# Altium project MiniPTM.PrjPcb (part 4 of 4)

## Sheet 15-M2_GNSS.SchDoc
size A3; SheetNumber: 14; SheetTotal: 15
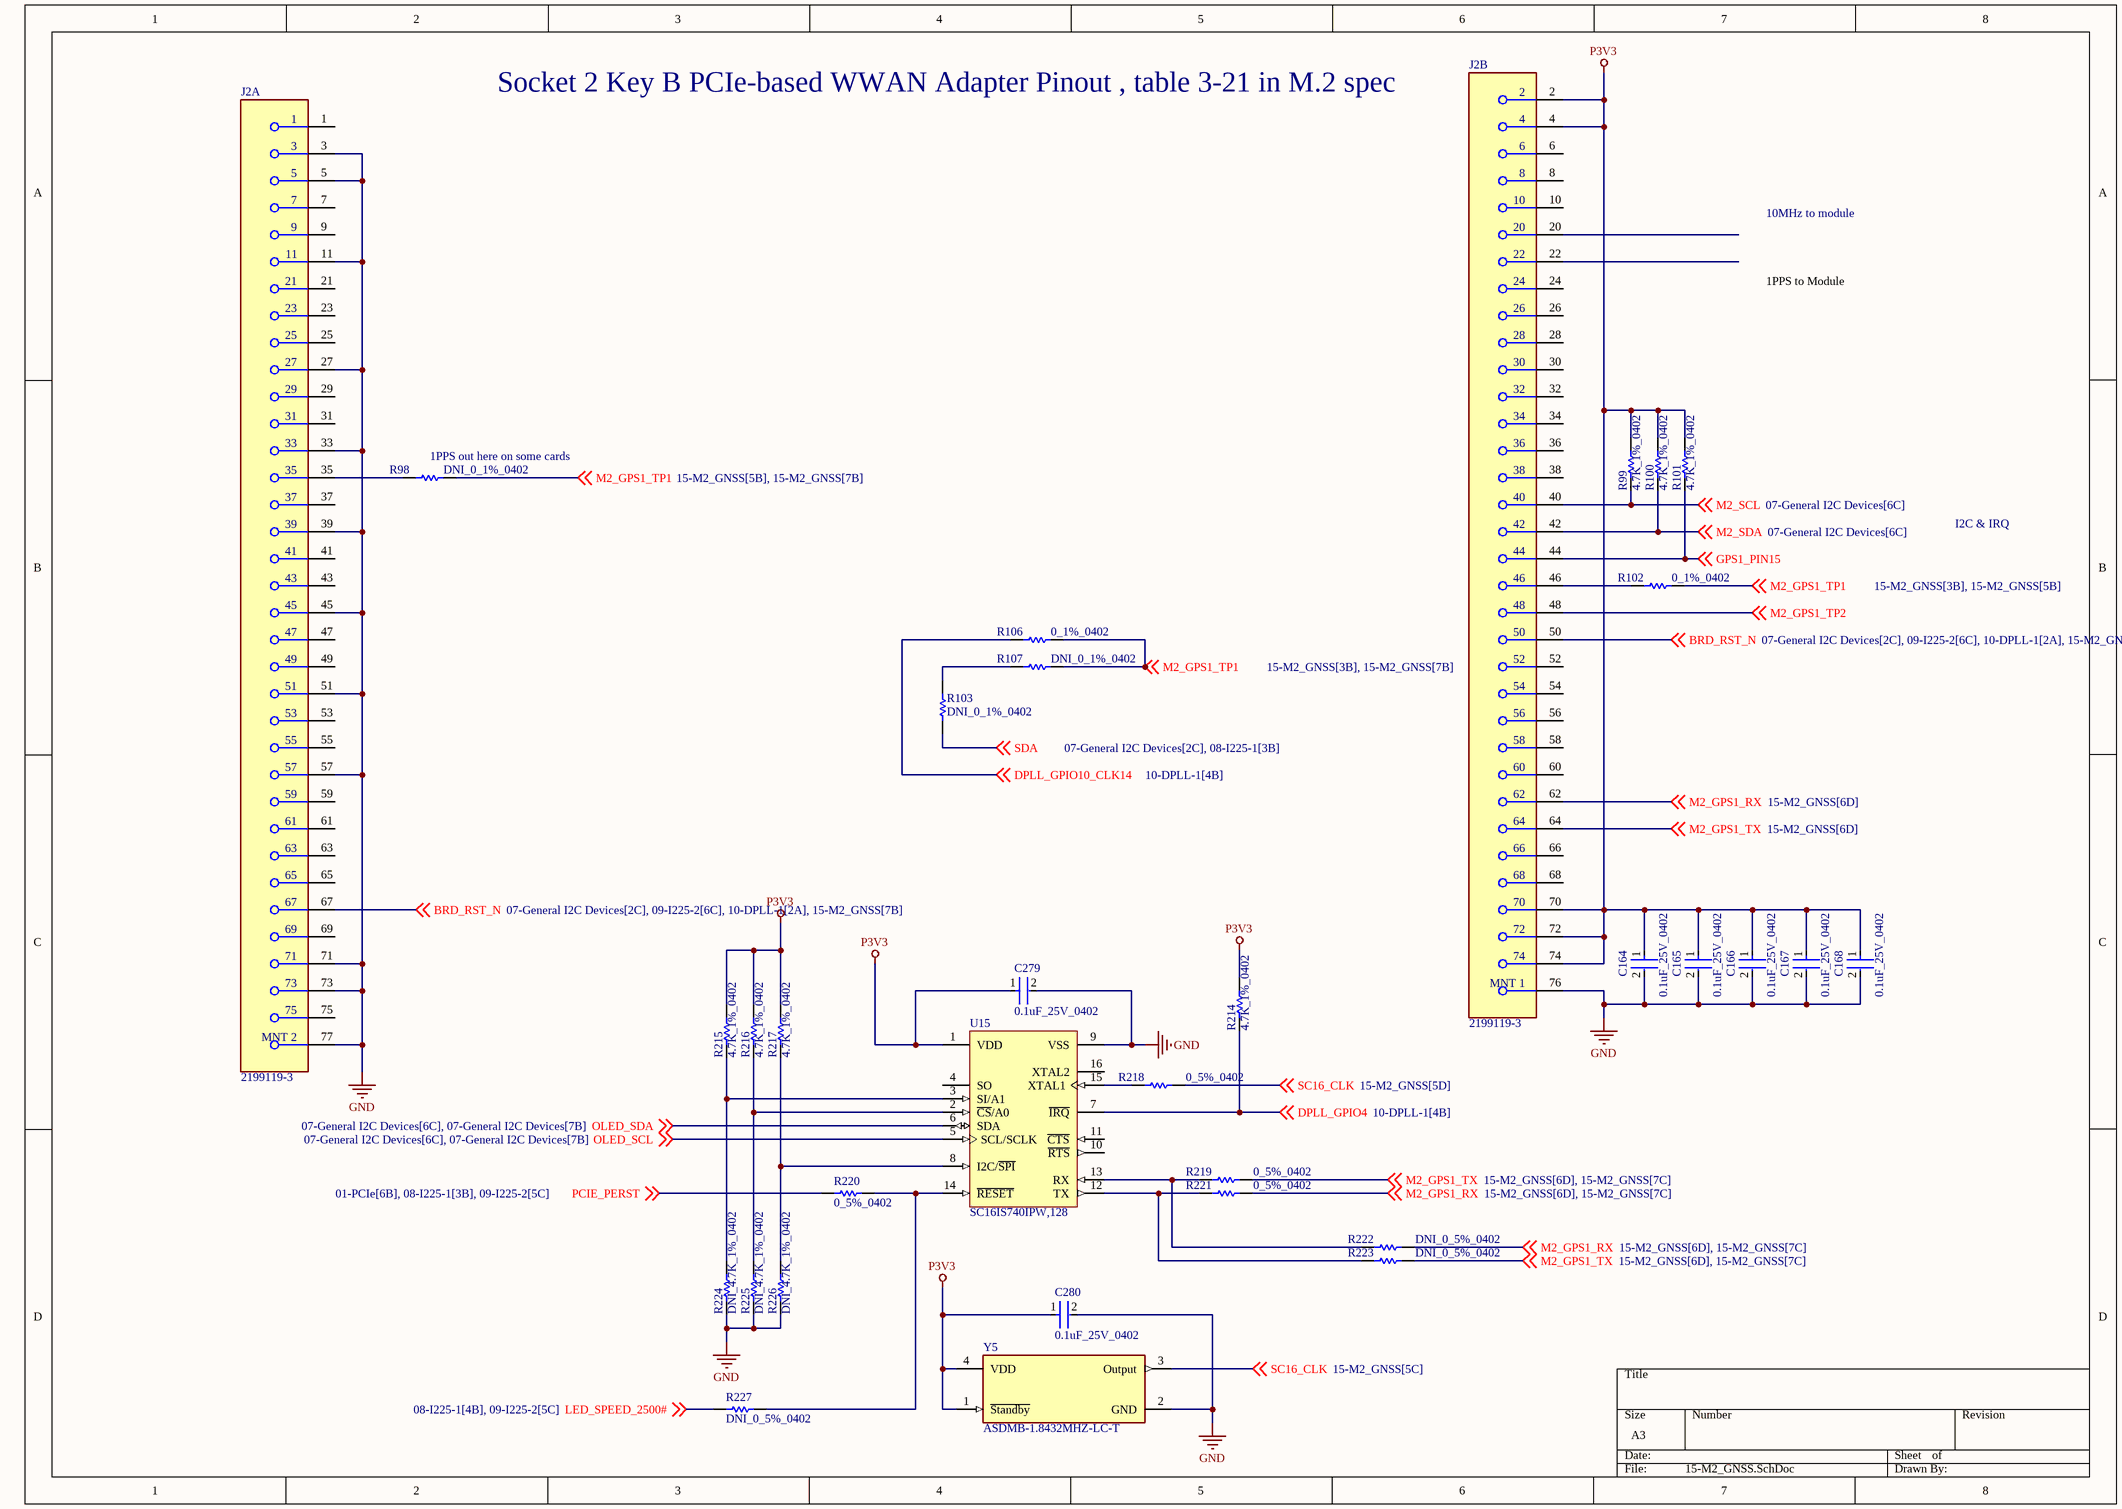
[diagram p14: 15-M2_GNSS.SchDoc]

### Parts
C164  0.1uF_25V_0402  [FP-0402-L_1_0_1-W_0_5_0_1-IPC_C]
C165  0.1uF_25V_0402  [FP-0402-L_1_0_1-W_0_5_0_1-IPC_C]
C166  0.1uF_25V_0402  [FP-0402-L_1_0_1-W_0_5_0_1-IPC_C]
C167  0.1uF_25V_0402  [FP-0402-L_1_0_1-W_0_5_0_1-IPC_C]
C168  0.1uF_25V_0402  [FP-0402-L_1_0_1-W_0_5_0_1-IPC_C]
C279  0.1uF_25V_0402  [FP-0402-L_1_0_1-W_0_5_0_1-IPC_C]
C280  0.1uF_25V_0402  [FP-0402-L_1_0_1-W_0_5_0_1-IPC_C]
J2  2199119-3  [FP-2199119-3-MFG]  (parts A,B of 2)
R98  DNI_0_1%_0402  [RESC1005X40X25LL05T05]  (no BOM)
R99  4.7K_1%_0402  [RESC1005X40X25NL10T10]
R100  4.7K_1%_0402  [RESC1005X40X25NL10T10]
R101  4.7K_1%_0402  [RESC1005X40X25NL10T10]
R102  0_1%_0402  [RESC1005X40X25LL05T05]
R103  DNI_0_1%_0402  [RESC1005X40X25LL05T05]  (no BOM)
R106  0_1%_0402  [RESC1005X40X25LL05T05]
R107  DNI_0_1%_0402  [RESC1005X40X25LL05T05]  (no BOM)
R214  4.7K_1%_0402  [RESC1005X40X25NL10T10]
R215  4.7K_1%_0402  [RESC1005X40X25NL10T10]
R216  4.7K_1%_0402  [RESC1005X40X25NL10T10]
R217  4.7K_1%_0402  [RESC1005X40X25NL10T10]
R218  0_5%_0402  [RESC1005X40X25LL10T10]
R219  0_5%_0402  [RESC1005X40X25LL10T10]
R220  0_5%_0402  [RESC1005X40X25LL10T10]
R221  0_5%_0402  [RESC1005X40X25LL10T10]
R222  DNI_0_5%_0402  [RESC1005X40X25LL10T10]  (no BOM)
R223  DNI_0_5%_0402  [RESC1005X40X25LL10T10]  (no BOM)
R224  DNI_4.7K_1%_0402  [RESC1005X40X25NL10T10]  (no BOM)
R225  DNI_4.7K_1%_0402  [RESC1005X40X25NL10T10]  (no BOM)
R226  DNI_4.7K_1%_0402  [RESC1005X40X25NL10T10]  (no BOM)
R227  DNI_0_5%_0402  [RESC1005X40X25LL10T10]  (no BOM)
U15  SC16IS740IPW,128  [NXP-SOT403-1_V]
Y5  ASDMB-1.8432MHZ-LC-T  [FP-ASDM-ASDMB-MFG]

### Nets
GND: C164.2 C165.2 C166.2 C167.2 C168.2 C279.2 C280.2 J2.3 J2.5 J2.11 J2.27 J2.33 J2.39 J2.45 J2.51 J2.57 J2.71 J2.73 J2.76(MNT_1) J2.77(MNT_2) R224.1 R225.1 R226.1 U15.9(VSS) Y5.2(GND)
P3V3: C164.1 C165.1 C166.1 C167.1 C168.1 C279.1 C280.1 J2.2 J2.4 J2.70 J2.72 J2.74 R99.2 R100.2 R101.2 R214.2 R215.2 R216.2 R217.2 U15.1(VDD) Y5.1(~{Standby}) Y5.4(VDD)
BRD_RST_N: J2.50 J2.67 ; off-sheet BRD_RST_N
DPLL_GPIO4: R214.1 U15.7(~{IRQ}) ; off-sheet DPLL_GPIO4
DPLL_GPIO10_CLK14: R106.1 ; off-sheet DPLL_GPIO10_CLK14
GPS1_PIN15: J2.44 R101.1 ; off-sheet GPS1_PIN15
LED_SPEED_2500#: R227.2 ; off-sheet LED_SPEED_2500#
M2_GPS1_RX: J2.62 R221.1 R222.1 ; off-sheet M2_GPS1_RX
M2_GPS1_TP1: R98.2 R102.2 R106.2 R107.2 ; off-sheet M2_GPS1_TP1
M2_GPS1_TP2: J2.48 ; off-sheet M2_GPS1_TP2
M2_GPS1_TX: J2.64 R219.1 R223.1 ; off-sheet M2_GPS1_TX
M2_SCL: J2.40 R99.1 ; off-sheet M2_SCL
M2_SDA: J2.42 R100.1 ; off-sheet M2_SDA
OLED_SCL: U15.5(SCL/SCLK) ; off-sheet OLED_SCL
OLED_SDA: U15.6(SDA) ; off-sheet OLED_SDA
PCIE_PERST: R220.2 ; off-sheet PCIE_PERST
SC16_CLK: R218.1 Y5.3(Output) ; off-sheet SC16_CLK
SDA: R103.1 ; off-sheet SDA
NetJ2_35: J2.35 R98.1
NetJ2_46: J2.46 R102.1
NetR103_2: R103.2 R107.1
NetR215_1: R215.1 R224.2 U15.3(SI/A1)
NetR216_1: R216.1 R225.2 U15.2(~{CS}/A0)
NetR217_1: R217.1 R226.2 U15.8(I2C/~{SPI})
NetR218_2: R218.2 U15.15(XTAL1)
NetR219_2: R219.2 R222.2 U15.13(RX)
NetR220_1: R220.1 R227.1 U15.14(~{RESET})
NetR221_2: R221.2 R223.2 U15.12(TX)

Not connected (* = marked no-connect by the designer): J2 1 6 7 8 9 10 20 21 22 23 24 25 26 28 29 30 31 32 34 36 37 38 41 43 47 49 52 53 54 55 56 58 59 60 61 63 65 66 68 69 75; U15 4(SO) 10(~{RTS}) 11(~{CTS}) 16(XTAL2)

### Notes on the sheet
- (near J2) Socket 2 Key B PCIe-based WWAN Adapter Pinout , table 3-21 in M.2 spec
- 10MHz to module
- 1PPS to Module
- (near R98) 1PPS out here on some cards
- I2C & IRQ

### Library data of the parts
C164-C168 C279 C280 = CMP-2008-02519-2: General Purpose Ceramic Capacitor, 0402, 100nF, 10%, X7R, 15%, 25V; Package Quantity: 1; Capacitance: 100nF; Min Operating Temperature: -55°C; Voltage: 25V; Voltage Rating: 25V; Construction: Flat; Max Operating Temperature: 125°C; Radiation Hardening: No; Depth: 0.5mm; Thickness: 0.022inch; Voltage Rating (DC): 25V; Number of Pins: 2; Lead Free: Lead Free; Series: -; REACH SVHC: No SVHC; Length: 1mm; Dielectric: X7R; RoHS Compliant: Yes; Mount: Surface Mount; Packaging: Tape and Reel; Case/Package: 0402; Case Code (Imperial): 0402; Termination: SMD/SMT; Width: 0.02inch; Case Code (Metric): 1005; Tolerance: 10%
J2 = CMP-03365-000004-1: CONN M.2 FEMALE 67POS 0.020 GOLD; Contact Current Rating: 500mA; Number of Contacts: 67; PCB Mounting Orientation: Right Angle; Pitch: 0.5mm; Voltage Rating: 50V; Insulation Resistance: 500MR; Row Spacing: 7.55mm; Orientation: Right Angle; Length: 0.862inch; Radiation Hardening: No; Mount: Surface Mount; Contact Plating: Gold; Contact Material: Copper Alloy; Width: 8.7mm; Number of Rows: 2; Color: Black; ELV: Compliant; Housing Color: Black; Number of Positions: 67; Housing Material: Thermoplastic; Gender: Female; Min Operating Temperature: -40°C; Max Operating Temperature: 80°C; RoHS Compliant: Yes; Package Quantity: 1200; Packaging: Tape and Reel; Height: 3.2mm; Termination: Solder; Insulation Material: Thermoplastic; Max Voltage Rating (AC): 50V; Current Rating: 500mA
R98 R102 R103 R106 R107 = CMP-2000-07451-1: Chip Resistor, 0 Ohm, 0.1 W, -55 to 155 degC, 0402 (1005 Metric), RoHS, Tape and Reel; Manufacturer: Panasonic; Voltage Rating (DC): 50V; Temperature Coefficient: 600ppm/��C; Max Power Dissipation: 100mW; Resistance: 0mOhm; Tolerance: 5%; Number of Terminations: 2; Mount: SurfaceMount; Height: 0.35mm; Packaging: TapeandReel; Contact Plating: Tin; Manufacturer URL: http://www.panasonic.com/; Composition: ThickFilm; Max Operating Temperature: 155degC; REACH SVHC: NoSVHC; Case/Package: 0402; Package Reference: 402; Depth: 0.5mm; Package Description: 2-Pin Surface Mount Device, Body 1 x 0.5 mm; Datasheet URL: https://industrial.panasonic.com/cdbs/www-data/pdf/RDA0000/AOA0000C301.pdf; RoHSCompliant: True; Case Code (Imperial): 0402; Military Standard: Not; Min Operating Temperature: -55degC; Power Rating: 100mW; Datasheet Version: 03/2015; Length: 1mm; Case Code (Metric): 1005; Termination: SMD/SMT; Mounting Technology: SurfaceMount; Voltage Rating: 50V; Width: 0.02inch; Package Quantity: 1; Lead Free: LeadFree; Radiation Hardening: No
R99-R101 R214-R217 R224-R226 = CMP-2002-05217-1: Manufacturer: Bourns; Part Number: CR0402-FX-4701GLF
R218-R223 R227 = CMP-2002-04569-1: Manufacturer: KOA Speer; Part Number: RK73Z1ETTP
U15 = CMP-1651-00006-1: Single UART with I2C-Bus/SPI Interface, 64 Bytes of Transmit and Receive FIFOs, IrDA SIR Built-in Support, 2.3 to 3.6 V, -40 to 95 degC, 16-Pin TSSOP (SOT403-1), RoHS, Tape and Reel; Data Rate: 5 Mbps; Supply Voltage Min: 2.3 V; Supply Current Max: 6 mA; Supply Voltage Max: 3.6 V; ComponentLink2Description: Datasheet; Generic Part Number: SC16IS740; ComponentLink3Description: Package Specification; ComponentLink1Description: Manufacturer URL; PackageDescription: 16-Pin Plastic Thin Shrink Small Outline Package, Body 5 x 4.4 mm, Pitch 0.65 mm; Mounting Technology: Surface Mount; Code_JEDEC: MO-153; DatasheetVersion: Rev. 7; Temperature Min: -40 degC; PartNumber: SC16IS740IPW,128; ComponentLink3URL: http://www.nxp.com/documents/outline_drawing/sot403-1_po.pdf; ComponentLink2URL: http://cache.nxp.com/documents/data_sheet/SC16IS740_750_760.pdf?pspll=1; Packing: Tape and Reel; ComponentLink1URL: http://www.nxp.com/; Temperature Max: 95 degC; RoHS: TRUE; PackageVersion: 03-02-18, 02/2003
Y5 = CMP-27762-001563-1: MEMS Oscillator 1.8432MHz ±50ppm LVCMOS 1.8V~3.3V SMD 2.5x2mm; Operating Supply Voltage: 3.3V; Load Capacitance: 15pF; Max Supply Voltage: 4V; Min Supply Voltage: -300mV; Max Supply Current: 16mA; Frequency Stability: 50ppm; Frequency: 1.8432MHz; Height: 0.035inch; Mount: Surface Mount; Max Operating Temperature: 85°C; RoHS Compliant: Yes; Min Operating Temperature: -40°C; Packaging: Tape and Reel; Number of Pins: 4; Length: 0.098inch; Width: 0.079inch; Case/Package: SMD/SMT; Series: Pure Silicon™ ASDMB; Termination: SMD/SMT

## Sheet 16-DPLL_Spare_UFL.SchDoc
size A3; SheetNumber: 15; SheetTotal: 15
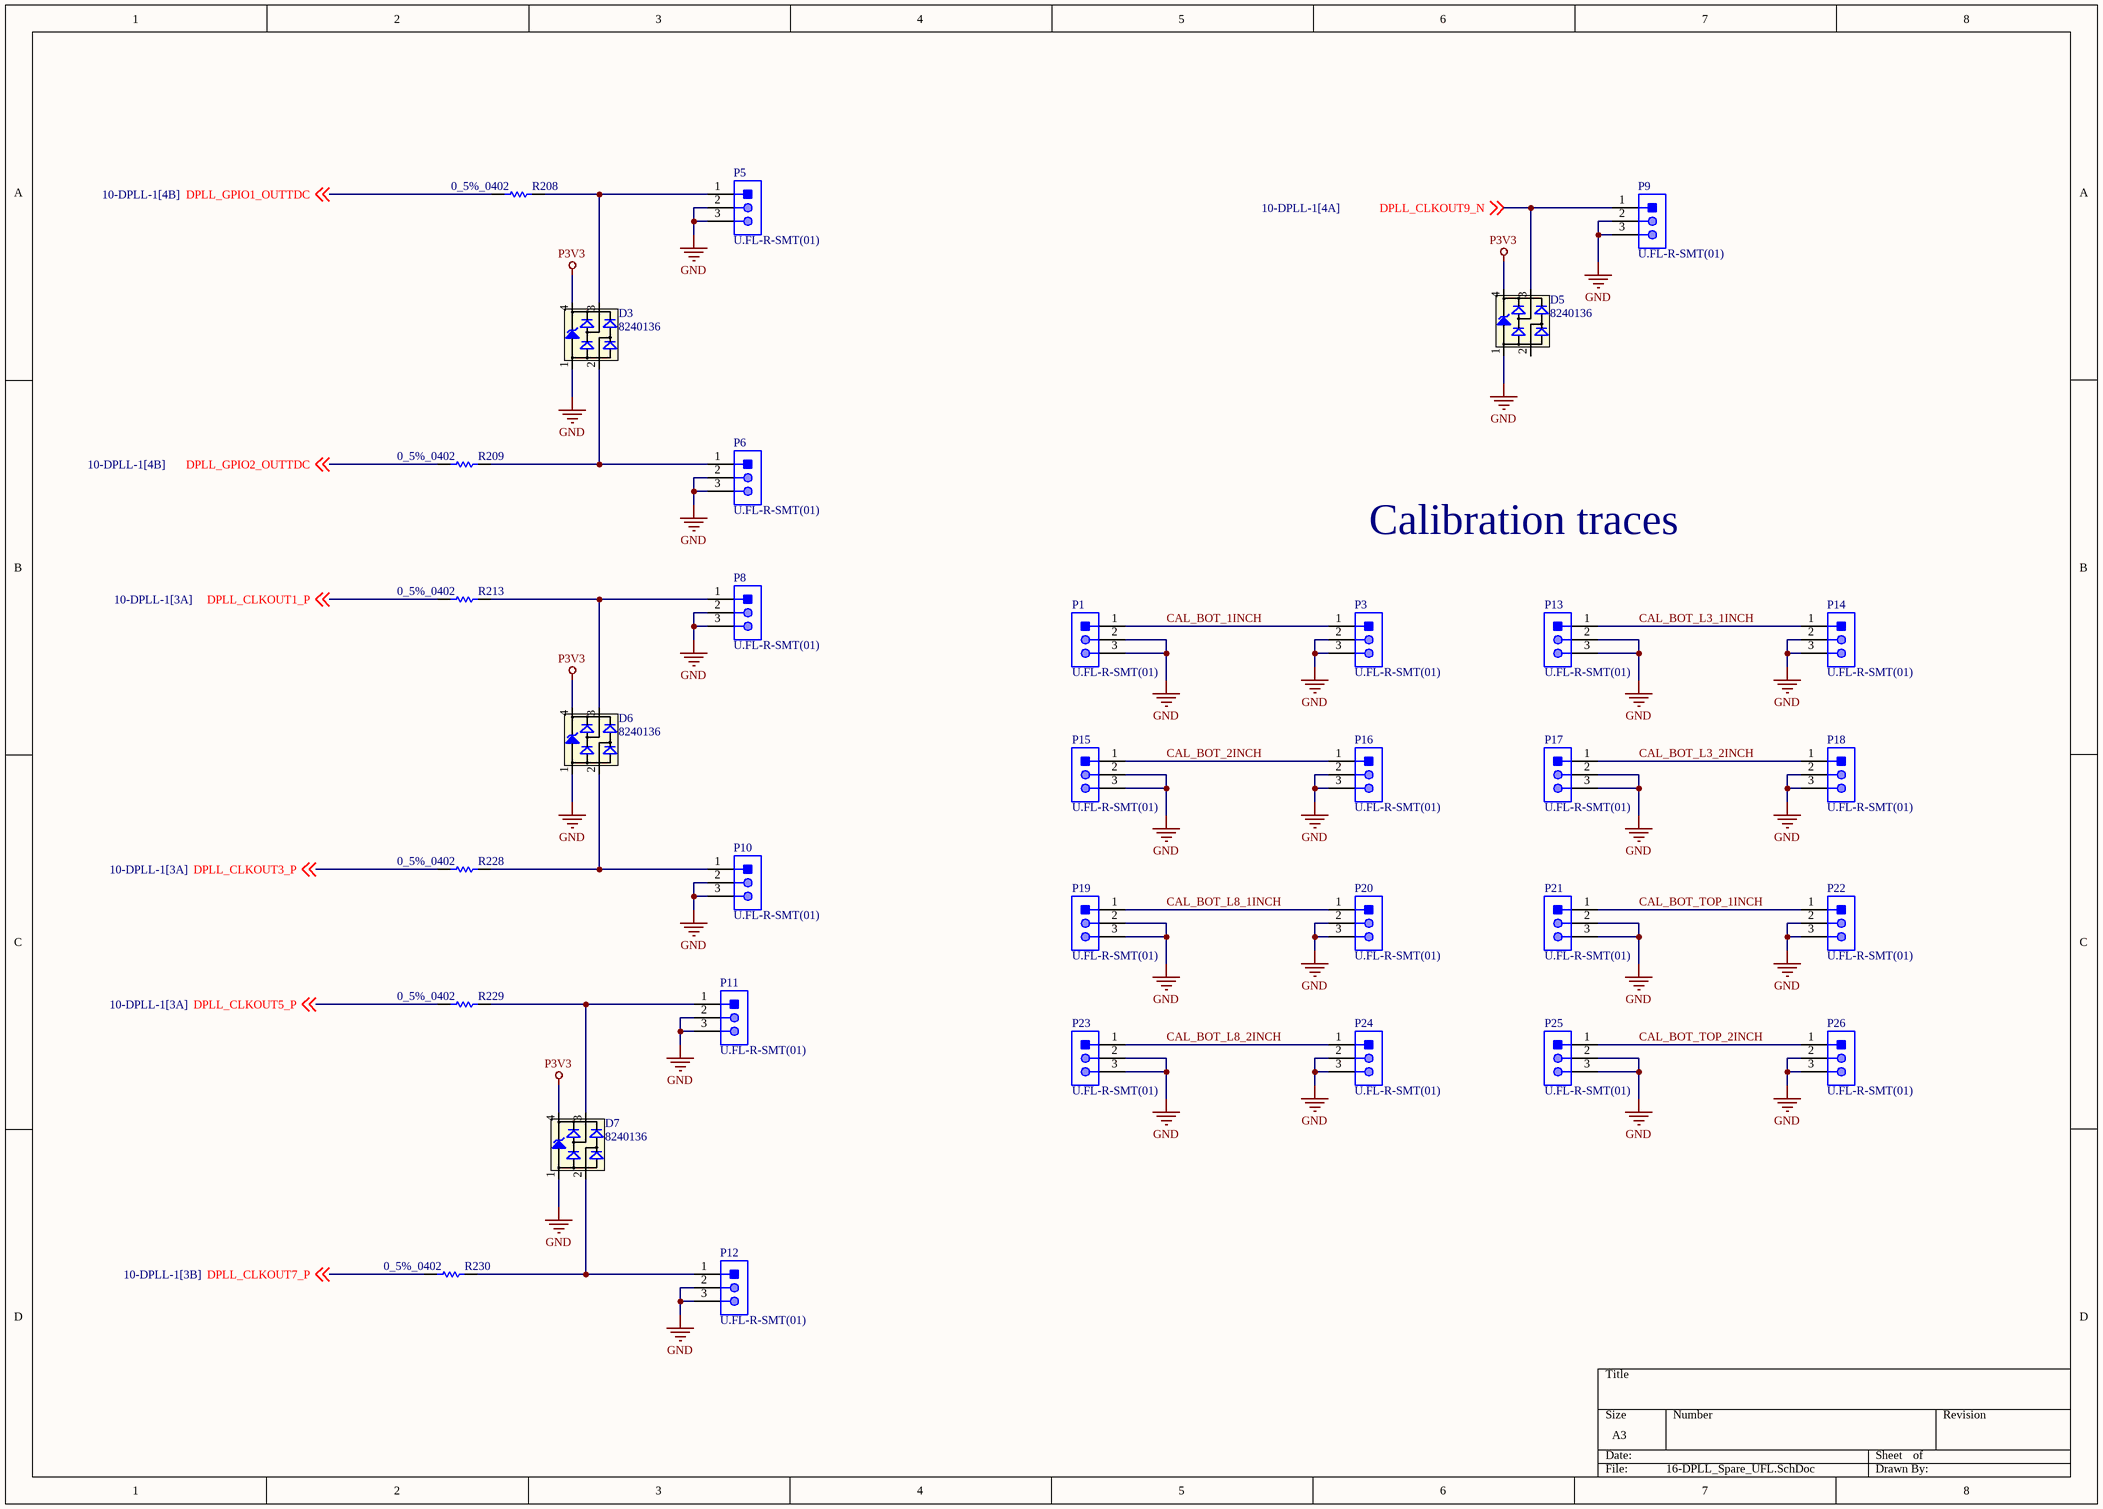
[diagram p15: 16-DPLL_Spare_UFL.SchDoc]

### Parts
D3  8240136  [SOT143-4L]
D5  8240136  [SOT143-4L]
D6  8240136  [SOT143-4L]
D7  8240136  [SOT143-4L]
P1  U.FL-R-SMT(01)  [HRS-U.FL-R-SMT(10)_V]
P3  U.FL-R-SMT(01)  [HRS-U.FL-R-SMT(10)_V]
P5  U.FL-R-SMT(01)  [HRS-U.FL-R-SMT(10)_V]
P6  U.FL-R-SMT(01)  [HRS-U.FL-R-SMT(10)_V]
P8  U.FL-R-SMT(01)  [HRS-U.FL-R-SMT(10)_V]
P9  U.FL-R-SMT(01)  [HRS-U.FL-R-SMT(10)_V]
P10  U.FL-R-SMT(01)  [HRS-U.FL-R-SMT(10)_V]
P11  U.FL-R-SMT(01)  [HRS-U.FL-R-SMT(10)_V]
P12  U.FL-R-SMT(01)  [HRS-U.FL-R-SMT(10)_V]
P13  U.FL-R-SMT(01)  [HRS-U.FL-R-SMT(10)_V]
P14  U.FL-R-SMT(01)  [HRS-U.FL-R-SMT(10)_V]
P15  U.FL-R-SMT(01)  [HRS-U.FL-R-SMT(10)_V]
P16  U.FL-R-SMT(01)  [HRS-U.FL-R-SMT(10)_V]
P17  U.FL-R-SMT(01)  [HRS-U.FL-R-SMT(10)_V]
P18  U.FL-R-SMT(01)  [HRS-U.FL-R-SMT(10)_V]
P19  U.FL-R-SMT(01)  [HRS-U.FL-R-SMT(10)_V]
P20  U.FL-R-SMT(01)  [HRS-U.FL-R-SMT(10)_V]
P21  U.FL-R-SMT(01)  [HRS-U.FL-R-SMT(10)_V]
P22  U.FL-R-SMT(01)  [HRS-U.FL-R-SMT(10)_V]
P23  U.FL-R-SMT(01)  [HRS-U.FL-R-SMT(10)_V]
P24  U.FL-R-SMT(01)  [HRS-U.FL-R-SMT(10)_V]
P25  U.FL-R-SMT(01)  [HRS-U.FL-R-SMT(10)_V]
P26  U.FL-R-SMT(01)  [HRS-U.FL-R-SMT(10)_V]
R208  0_5%_0402  [RESC1005X40X25LL10T10]
R209  0_5%_0402  [RESC1005X40X25LL10T10]
R213  0_5%_0402  [RESC1005X40X25LL10T10]
R228  0_5%_0402  [RESC1005X40X25LL10T10]
R229  0_5%_0402  [RESC1005X40X25LL10T10]
R230  0_5%_0402  [RESC1005X40X25LL10T10]

### Nets
GND: D3.1(GND) D5.1(GND) D6.1(GND) D7.1(GND) P1.2 P1.3 P3.2 P3.3 P5.2 P5.3 P6.2 P6.3 P8.2 P8.3 P9.2 P9.3 P10.2 P10.3 P11.2 P11.3 P12.2 P12.3 P13.2 P13.3 P14.2 P14.3 P15.2 P15.3 P16.2 P16.3 P17.2 P17.3 P18.2 P18.3 P19.2 P19.3 P20.2 P20.3 P21.2 P21.3 P22.2 P22.3 P23.2 P23.3 P24.2 P24.3 P25.2 P25.3 P26.2 P26.3
P3V3: D3.4(VDD) D5.4(VDD) D6.4(VDD) D7.4(VDD)
CAL_BOT_1INCH: P1.1 P3.1
CAL_BOT_2INCH: P15.1 P16.1
CAL_BOT_L3_1INCH: P13.1 P14.1
CAL_BOT_L3_2INCH: P17.1 P18.1
CAL_BOT_L8_1INCH: P19.1 P20.1
CAL_BOT_L8_2INCH: P23.1 P24.1
CAL_BOT_TOP_1INCH: P21.1 P22.1
CAL_BOT_TOP_2INCH: P25.1 P26.1
DPLL_CLKOUT1_P: R213.1 ; off-sheet DPLL_CLKOUT1_P
DPLL_CLKOUT3_P: R228.1 ; off-sheet DPLL_CLKOUT3_P
DPLL_CLKOUT5_P: R229.1 ; off-sheet DPLL_CLKOUT5_P
DPLL_CLKOUT7_P: R230.1 ; off-sheet DPLL_CLKOUT7_P
DPLL_CLKOUT9_N: D5.3(I/O2) P9.1 ; off-sheet DPLL_CLKOUT9_N
DPLL_GPIO1_OUTTDC: R208.1 ; off-sheet DPLL_GPIO1_OUTTDC
DPLL_GPIO2_OUTTDC: R209.1 ; off-sheet DPLL_GPIO2_OUTTDC
NetD3_2: D3.2(I/O1) P6.1 R209.2
NetD3_3: D3.3(I/O2) P5.1 R208.2
NetD6_2: D6.2(I/O1) P10.1 R228.2
NetD6_3: D6.3(I/O2) P8.1 R213.2
NetD7_2: D7.2(I/O1) P12.1 R230.2
NetD7_3: D7.3(I/O2) P11.1 R229.2

Not connected (* = marked no-connect by the designer): D5 2(I/O1)

### Notes on the sheet
- Calibration traces

### Library data of the parts
D3 D5-D7 = CMP-1486-00002-1: TVS Diode WE-TVS-HS, VRWM=3.3V; Manufacturer: Wuerth Elektronik; Reverse Stand Off Voltage: 3.3V; PartNumber: 8240136; ComponentLink1Description: Manufacturer URL; PackageReference: SOT143-4L; ComponentLink1URL: http://www.we-online.com; ComponentLink2Description: Datasheet; ComponentLink2URL: http://katalog.we-online.de/kataloge/eisos/media/pdf/8240136.pdf
P1 P3 P5 P6 P8-P26 = CMP-2000-05151-1: CONN RECPT ULTRA-MINI COAX SMD; Manufacturer: Hirose Electric; Centre Contact Resistance: 25mohm; Voltage Rating V AC: 60V; Female Contact Material: PhosphorBronze; Contact Resistance: 10mohm; Male Contact Material: Brass; Connector Type: UFLCoaxial; Connector Mounting: PCB; Impedance: 50ohm; Insulation Resistance: 500Mohm; Secondary Insulation Material: PBT; Frequency Max: 6GHz; Body Plating: Silver; External Length / Height: 2.5mm; Approval Category: UL94V-0; Female Contact Plating: Gold; Connector Mounting Orientation: PCBoard; VSWR: 1.3; Coaxial Termination: Solder; Body Style: StraightJack; SVHC: NoSVHC(18-Jun-2012); Jacket Material: LCP; Package Reference: U.FL-R-SMT(10); Datasheet Version: Feb-04; Outer Contact Resistance: 10mohm; Contact Plating: Gold; Mounting Type: PCBoard; Flammability Rating: UL94V-0; Operating Frequency Max: 6GHz; Termination Method: Solder; Male Contact Plating: Gold; Package Description: 3-Pin Surface Mount Device, Body 2.6 x 2.6 mm; Operating Temperature Min: -40degC; Manufacturer URL: https://www.hirose.com; Operating Temperature Max: 90degC; Contact Material: PhosphorBronze; Datasheet URL: http://www.farnell.com/datasheets/91524.pdf; Material: PhosphorBronze
R208 R209 R213 R228-R230 = CMP-2002-04569-1: as R218 on sheet 15-M2_GNSS

## Nets that join several sheets
+12V: 12-POWER-P12V (7 pins), 13-Power-P3V3 (8 pins)
+12V_PCIE: 01-PCIe (5 pins), 12-POWER-P12V (CR1.1 R44.1)
DPLL_VDD_CLKA: 10-DPLL-1 (U7.G3), 11-DPLL-2 (C134.1 C135.1 L15.2)
DPLL_VDD_CLKB: 10-DPLL-1 (U7.H3), 11-DPLL-2 (C120.1 C121.1 L11.2)
DPLL_VDD_DCO_Q01: 10-DPLL-1 (U7.D9), 11-DPLL-2 (C102.1 C103.1 L6.2)
DPLL_VDD_DCO_Q8: 10-DPLL-1 (U7.D7), 11-DPLL-2 (C250.1 C251.1 L23.2)
DPLL_VDD_DCO_Q9: 10-DPLL-1 (U7.F9), 11-DPLL-2 (C253.1 C254.1 L24.2)
DPLL_VDD_DCO_Q10: 10-DPLL-1 (U7.G9), 11-DPLL-2 (C256.1 C257.1 L25.2)
DPLL_VDD_DCO_Q11: 10-DPLL-1 (U7.J7), 11-DPLL-2 (C259.1 C260.1 L26.2)
DPLL_VDD_DCO_Q23: 10-DPLL-1 (U7.D8), 11-DPLL-2 (C113.1 C114.1 L9.2)
DPLL_VDD_DCO_Q45: 10-DPLL-1 (U7.J8), 11-DPLL-2 (C242.1 C243.1 L21.2)
DPLL_VDD_DCO_Q67: 10-DPLL-1 (U7.J9), 11-DPLL-2 (C247.1 C248.1 L22.2)
DPLL_VDD_DIA_A: 10-DPLL-1 (U7.F7), 11-DPLL-2 (C77.1 C78.1 L3.2)
DPLL_VDD_DIA_B: 10-DPLL-1 (U7.G7), 11-DPLL-2 (C92.1 C93.1 L4.2)
DPLL_VDD_DIG: 10-DPLL-1 (U7.G5 U7.H5), 11-DPLL-2 (5 pins)
DPLL_VDD_GPIO: 10-DPLL-1 (U7.J4), 11-DPLL-2 (5 pins)
DPLL_VDDA_BG_LC: 10-DPLL-1 (U7.J5 U7.K4), 11-DPLL-2 (C83.1 C84.1 C85.1 L2.2)
DPLL_VDDA_FB: 10-DPLL-1 (U7.E5), 11-DPLL-2 (C125.1 C126.1 L13.2)
DPLL_VDDA_PDCP_XTAL: 10-DPLL-1 (U7.D4 U7.E4), 11-DPLL-2 (C99.1 C100.1 L5.2)
DPLL_VDDO_Q0: 10-DPLL-1 (U7.C8), 11-DPLL-2 (C111.1 C112.1 L8.2)
DPLL_VDDO_Q1: 10-DPLL-1 (U7.C9), 11-DPLL-2 (C127.1 C128.1 L12.2)
DPLL_VDDO_Q2: 10-DPLL-1 (U7.C11), 11-DPLL-2 (C139.1 C140.1 L16.2)
DPLL_VDDO_Q3: 10-DPLL-1 (U7.C12), 11-DPLL-2 (C148.1 C149.1 L18.2)
DPLL_VDDO_Q4: 10-DPLL-1 (U7.K12), 11-DPLL-2 (C106.1 C107.1 L7.2)
DPLL_VDDO_Q5: 10-DPLL-1 (U7.K11), 11-DPLL-2 (C118.1 C119.1 L10.2)
DPLL_VDDO_Q6: 10-DPLL-1 (U7.K9), 11-DPLL-2 (C132.1 C133.1 L14.2)
DPLL_VDDO_Q7: 10-DPLL-1 (U7.K8), 11-DPLL-2 (C143.1 C144.1 L17.2)
DPLL_VDDO_Q8: 10-DPLL-1 (U7.C6), 11-DPLL-2 (C264.1 C265.1 L27.2)
DPLL_VDDO_Q9: 10-DPLL-1 (U7.E10), 11-DPLL-2 (C268.1 C269.1 L28.2)
DPLL_VDDO_Q10: 10-DPLL-1 (U7.H10), 11-DPLL-2 (C276.1 C277.1 L30.2)
DPLL_VDDO_Q11: 10-DPLL-1 (U7.K6), 11-DPLL-2 (C274.1 C275.1 L29.2)
GND: 01-PCIe (45 pins), 02-USER_IO (18 pins), 05-Front Panel SFP_1 (70 pins), 06-Front Panel SFP_2 (60 pins), 07-General I2C Devices (9 pins), 08-I225-1 (11 pins), 09-I225-2 (37 pins), 10-DPLL-1 (49 pins), 11-DPLL-2 (124 pins), 12-POWER-P12V (10 pins), 13-Power-P3V3 (19 pins), 14-Power-P1V8 (11 pins), 15-M2_GNSS (25 pins), 16-DPLL_Spare_UFL (50 pins)
P0V95_I225: 08-I225-1 (7 pins), 09-I225-2 (11 pins)
P1V8: 11-DPLL-2 (27 pins), 14-Power-P1V8 (5 pins)
P3V3: 01-PCIe (20 pins), 02-USER_IO (6 pins), 03-USER_IO_STATUS (D9.2 D10.2 D11.2), 05-Front Panel SFP_1 (34 pins), 06-Front Panel SFP_2 (34 pins), 07-General I2C Devices (16 pins), 08-I225-1 (15 pins), 09-I225-2 (23 pins), 10-DPLL-1 (5 pins), 11-DPLL-2 (56 pins), 13-Power-P3V3 (11 pins), 14-Power-P1V8 (7 pins), 15-M2_GNSS (22 pins), 16-DPLL_Spare_UFL (D3.4 D5.4 D6.4 D7.4)
ANT1_IO_SEL: 02-USER_IO (U1.9), 10-DPLL-1 (U7.G11)
ANT2_IO_SEL: 02-USER_IO (U4.9), 10-DPLL-1 (U7.A3)
BRD_RST_N: 07-General I2C Devices (R121.1), 09-I225-2 (R125.2 U17.3), 10-DPLL-1 (R59.1), 15-M2_GNSS (J2.50 J2.67)
DPLL_CLKIN_0_N: 05-Front Panel SFP_1 (C20.2 R86.1 R175.2 R178.1), 10-DPLL-1 (U7.B2)
DPLL_CLKIN_0_P: 05-Front Panel SFP_1 (C19.2 R64.1 R174.2 R178.2), 10-DPLL-1 (U7.B1)
DPLL_CLKIN_1_N: 01-PCIe (C236.2 R18.1 R105.2), 10-DPLL-1 (U7.C2)
DPLL_CLKIN_1_P: 01-PCIe (C230.2 R9.1 R104.2), 10-DPLL-1 (U7.C1)
DPLL_CLKIN_2_N: 05-Front Panel SFP_1 (C171.2 R180.1 R188.1 R195.2), 10-DPLL-1 (U7.D2)
DPLL_CLKIN_2_P: 05-Front Panel SFP_1 (C170.2 R180.2 R186.1 R194.2), 10-DPLL-1 (U7.D1)
DPLL_CLKIN_4_N: 06-Front Panel SFP_2 (C173.2 R182.1 R198.1 R231.2), 10-DPLL-1 (U7.F2)
DPLL_CLKIN_4_P: 06-Front Panel SFP_2 (C172.2 R182.2 R197.1 R211.2), 10-DPLL-1 (U7.F1)
DPLL_CLKIN_6_N: 06-Front Panel SFP_2 (C175.2 R184.1 R233.1 R239.2), 10-DPLL-1 (U7.H2)
DPLL_CLKIN_6_P: 06-Front Panel SFP_2 (C174.2 R184.2 R232.1 R238.2), 10-DPLL-1 (U7.H1)
DPLL_CLKIN_7_N: 02-USER_IO (R122.2), 10-DPLL-1 (U7.J2)
DPLL_CLKIN_7_P: 02-USER_IO (R111.2), 10-DPLL-1 (U7.J1)
DPLL_CLKOUT0_N: 05-Front Panel SFP_1 (R113.2 R146.2), 10-DPLL-1 (U7.B8)
DPLL_CLKOUT0_P: 05-Front Panel SFP_1 (R113.1 R147.2), 10-DPLL-1 (U7.A8)
DPLL_CLKOUT1_P: 10-DPLL-1 (U7.A9), 16-DPLL_Spare_UFL (R213.1)
DPLL_CLKOUT2_N: 05-Front Panel SFP_1 (R179.2 R189.2), 10-DPLL-1 (U7.B11)
DPLL_CLKOUT2_P: 05-Front Panel SFP_1 (R179.1 R190.2), 10-DPLL-1 (U7.A11)
DPLL_CLKOUT3_P: 10-DPLL-1 (U7.A12), 16-DPLL_Spare_UFL (R228.1)
DPLL_CLKOUT4_N: 06-Front Panel SFP_2 (R181.2 R199.2), 10-DPLL-1 (U7.L12)
DPLL_CLKOUT4_P: 06-Front Panel SFP_2 (R181.1 R200.2), 10-DPLL-1 (U7.M12)
DPLL_CLKOUT5_P: 10-DPLL-1 (U7.M11), 16-DPLL_Spare_UFL (R229.1)
DPLL_CLKOUT6_N: 06-Front Panel SFP_2 (R183.2 R234.2), 10-DPLL-1 (U7.L9)
DPLL_CLKOUT6_P: 06-Front Panel SFP_2 (R183.1 R235.2), 10-DPLL-1 (U7.M9)
DPLL_CLKOUT7_P: 10-DPLL-1 (U7.M8), 16-DPLL_Spare_UFL (R230.1)
DPLL_CLKOUT8_P: 02-USER_IO (R110.2), 10-DPLL-1 (U7.A6)
DPLL_CLKOUT9_N: 10-DPLL-1 (U7.E11), 16-DPLL_Spare_UFL (D5.3 P9.1)
DPLL_CLKOUT9_P: 02-USER_IO (R112.2), 10-DPLL-1 (U7.E12)
DPLL_CLKOUT10_P: 02-USER_IO (R173.2), 10-DPLL-1 (U7.H12)
DPLL_GPIO0_CLK8: 02-USER_IO (R159.2), 10-DPLL-1 (U7.A10)
DPLL_GPIO1_OUTTDC: 10-DPLL-1 (U7.F11), 16-DPLL_Spare_UFL (R208.1)
DPLL_GPIO2_OUTTDC: 10-DPLL-1 (U7.F12), 16-DPLL_Spare_UFL (R209.1)
DPLL_GPIO3: 09-I225-2 (R242.2), 10-DPLL-1 (U7.J11)
DPLL_GPIO4: 10-DPLL-1 (U7.B10), 15-M2_GNSS (R214.1 U15.7)
DPLL_GPIO5: 03-USER_IO_STATUS (R38.1), 10-DPLL-1 (U7.D11)
DPLL_GPIO10_CLK14: 10-DPLL-1 (U7.M5), 15-M2_GNSS (R106.1)
DPLL_GPIO13: 03-USER_IO_STATUS (R36.1), 10-DPLL-1 (U7.A5)
DPLL_OSCI: 10-DPLL-1 (U7.B4), 11-DPLL-2 (C152.2 C278.2)
DPLL_SCL: 07-General I2C Devices (R120.1 U13.11), 10-DPLL-1 (U7.K2)
DPLL_SDA: 07-General I2C Devices (R119.1 U13.10), 10-DPLL-1 (U7.L2)
DPLL_XO: 10-DPLL-1 (U7.A1), 11-DPLL-2 (R62.1 R81.1)
I225_CLKREQ_N: 08-I225-1 (U5.3), 09-I225-2 (R51.1)
I225_DISABLE_N: 08-I225-1 (U5.2), 09-I225-2 (R54.1 R55.2)
I225_JTAG_CLK: 08-I225-1 (U5.29), 09-I225-2 (R57.2)
I225_JTAG_RSTN: 08-I225-1 (U5.16), 09-I225-2 (R56.2)
I225_LAN_PWR_GOOD: 08-I225-1 (U5.1), 09-I225-2 (R53.1)
I225_SDP0: 02-USER_IO (R60.1 R159.1), 08-I225-1 (R31.1)
I225_SDP1: 02-USER_IO (R61.1 R173.1), 08-I225-1 (R45.1)
I225_ULP_WAKE_N: 08-I225-1 (U5.4), 09-I225-2 (R50.1)
I225_WAKE_N: 08-I225-1 (U5.12), 09-I225-2 (R52.1)
LED4: 03-USER_IO_STATUS (R39.1), 10-DPLL-1 (U7.D12)
LED_LINK_ACT#: 08-I225-1 (U5.30), 09-I225-2 (R241.2)
LED_SPEED_1000#: 08-I225-1 (U5.32), 09-I225-2 (R240.2)
LED_SPEED_2500#: 08-I225-1 (U5.31), 09-I225-2 (U17.2), 15-M2_GNSS (R227.2)
M2_SCL: 07-General I2C Devices (U13.14), 15-M2_GNSS (J2.40 R99.1)
M2_SDA: 07-General I2C Devices (U13.13), 15-M2_GNSS (J2.42 R100.1)
MDI_A_N: 08-I225-1 (U5.46), 09-I225-2 (J10.3 U12.4)
MDI_A_P: 08-I225-1 (U5.45), 09-I225-2 (J10.1 U12.5)
MDI_B_N: 08-I225-1 (U5.49), 09-I225-2 (J10.6 U12.2)
MDI_B_P: 08-I225-1 (U5.48), 09-I225-2 (J10.4 U12.1)
MDI_C_N: 08-I225-1 (U5.52), 09-I225-2 (J10.9 U14.4)
MDI_C_P: 08-I225-1 (U5.51), 09-I225-2 (J10.7 U14.5)
MDI_D_N: 08-I225-1 (U5.55), 09-I225-2 (J10.12 U14.2)
MDI_D_P: 08-I225-1 (U5.54), 09-I225-2 (J10.10 U14.1)
OLED_SCL: 07-General I2C Devices (P7.3 R114.1 U13.20), 15-M2_GNSS (U15.5)
OLED_SDA: 07-General I2C Devices (P7.4 R85.1 U13.19), 15-M2_GNSS (U15.6)
PCIE_100M_CLK0_N: 01-PCIe (C229.2), 08-I225-1 (R30.1)
PCIE_100M_CLK0_P: 01-PCIe (C228.2), 08-I225-1 (R28.1)
PCIE_GF_I225_0_N: 01-PCIe (P2.B15), 08-I225-1 (R26.1)
PCIE_GF_I225_0_P: 01-PCIe (P2.B14), 08-I225-1 (R27.1)
PCIE_I225_GF_0_N: 01-PCIe (C47.2), 08-I225-1 (U5.24)
PCIE_I225_GF_0_P: 01-PCIe (C46.2), 08-I225-1 (U5.25)
PCIE_PERST: 01-PCIe (R22.1 R68.2), 08-I225-1 (U5.13), 09-I225-2 (R125.1 U17.1), 15-M2_GNSS (R220.2)
SCL: 07-General I2C Devices (R124.1 U13.22), 08-I225-1 (R43.1)
SDA: 07-General I2C Devices (R123.1 U13.23), 08-I225-1 (R42.1), 15-M2_GNSS (R103.1)
SFP1_SCL: 05-Front Panel SFP_1 (J5.P1_5 R4.2), 07-General I2C Devices (U13.5)
SFP1_SDA: 05-Front Panel SFP_1 (J5.P1_4 R3.2), 07-General I2C Devices (U13.4)
SFP2_SCL: 05-Front Panel SFP_1 (J5.P2_5 R12.2), 07-General I2C Devices (U13.7)
SFP2_SDA: 05-Front Panel SFP_1 (J5.P2_4 R11.2), 07-General I2C Devices (U13.6)
SFP3_SCL: 06-Front Panel SFP_2 (J5.P3_5 R137.2), 07-General I2C Devices (U13.16)
SFP3_SDA: 06-Front Panel SFP_2 (J5.P3_4 R136.2), 07-General I2C Devices (U13.15)
SFP4_SCL: 06-Front Panel SFP_2 (J5.P4_5 R151.2), 07-General I2C Devices (U13.18)
SFP4_SDA: 06-Front Panel SFP_2 (J5.P4_4 R150.2), 07-General I2C Devices (U13.17)
TOP_SENS_I2C_SCL: 07-General I2C Devices (R118.1 U3.1 U13.9), 11-DPLL-2 (Y2.3)
TOP_SENS_I2C_SDA: 07-General I2C Devices (R117.1 U3.3 U13.8), 11-DPLL-2 (Y2.2)

## Assembly variants
release: not fitted C152 C163 C237 C238 C239 P1 P3 P13 P14 P15 P16 P17 P18 P19 P20 P21 P22 P23 P24 P25 P26 R10 R44 R55 R59 R60 R61 R62 R78 R93 R98 R103 R107 R116 R130 R132 R133 R135 R143 R144 R145 R148 R155 R157 R166 R172 R177 R185 R207 R222 R223 R224 R225 R226 R227 U17
for_mechanic: not fitted C1 C2 C3 C4 C5 C6 C7 C8 C9 C10 C11 C12 C13 C14 C15 C16 C17 C18 C19 C20 C21 C22 C23 C24 C25 C26 C27 C28 C29 C30 C31 C32 C33 C34 C35 C36 C37 C38 C39 C40 C41 C42 C43 C44 C45 C46 C47 C48 C49 C50 C51 C52 C53 C54 C55 C56 C57 C58 C59 C60 C61 C62 C63 C64 C65 C66 C67 C68 C69 C70 C71 C72 C73 C74 C75 C76 C77 C78 C79 C80 C81 C82 C83 C84 C85 C86 C87 C88 C89 C90 C91 C92 C93 C94 C95 C96 C97 C98 C99 C100 C101 C102 C103 C104 C105 C106 C107 C108 C109 C110 C111 C112 C113 C114 C115 C116 C117 C118 C119 C120 C121 C122 C123 C124 C125 C126 C127 C128 C129 C130 C131 C132 C133 C134 C135 C136 C137 C138 C139 C140 C141 C142 C143 C144 C145 C146 C147 C148 C149 C150 C151 C152 C153 C154 C155 C156 C157 C158 C159 C160 C161 C162 C163 C164 C165 C166 C167 C168 C169 C170 C171 C172 C173 C174 C175 C177 C179 C180 C181 C182 C183 C186 C187 C192 C193 C194 C195 C196 C197 C198 C199 C200 C201 C202 C203 C204 C205 C206 C207 C212 C215 C216 C217 C218 C219 C220 C221 C222 C223 C224 C225 C226 C227 C228 C229 C230 C231 C232 C233 C234 C235 C236 C237 C238 C239 C240 C242 C243 C244 C245 C246 C247 C248 C249 C250 C251 C252 C253 C254 C255 C256 C257 C258 C259 C260 C261 C262 C263 C264 C265 C266 C267 C268 C269 C270 C271 C272 C273 C274 C275 C276 C277 C278 C279 C280 C281 C282 C284 C285 CR1 D1 D2 D3 D4 D5 D6 D7 D23 F1 FB1 FB2 FB3 FB4 FB5 FB6 FB7 FB8 FB9 L1 L2 L3 L4 L5 L6 L7 L8 L9 L10 L11 L12 L13 L14 L15 L16 L17 L18 L19 L20 L21 L22 L23 L24 L25 L26 L27 L28 L29 L30 P1 P2 P3 P4 P5 P6 P7 P8 P9 P10 P11 P12 P13 P14 P15 P16 P17 P18 P19 P20 P21 P22 P23 P24 P25 P26 R1 R2 R3 R4 R5 R6 R7 R8 R9 R10 R11 R12 R13 R14 R15 R16 R17 R18 R19 R20 R21 R22 R23 R24 R25 R26 R27 R28 R29 R30 R31 R32 R33 R34 R35 R36 R37 R38 R39 R40 R41 R42 R43 R44 R45 R46 R47 R48 R49 R50 R51 R52 R53 R54 R55 R56 R57 R58 R59 R60 R61 R62 R63 R64 R65 R66 R67 R68 R69 R70 R71 R72 R73 R74 R75 R76 R77 R78 R79 R80 R81 R82 R83 R84 R85 R86 R87 R88 R89 R90 R91 R92 R93 R94 R95 R96 R97 R98 R99 R100 R101 R102 R103 R104 R105 R106 R107 R108 R109 R110 R111 R112 R113 R114 R115 R116 R117 R118 R119 R120 R121 R122 R123 R124 R125 R126 R127 R128 R129 R130 R131 R132 R133 R134 R135 R136 R137 R138 R139 R140 R141 R142 R143 R144 R145 R146 R147 R148 R149 R150 R151 R152 R153 R154 R155 R156 R157 R158 R159 R160 R161 R162 R163 R164 R165 R166 R167 R168 R169 R170 R171 R172 R173 R174 R175 R176 R177 R178 R179 R180 R181 R182 R183 R184 R185 R186 R187 R188 R189 R190 R191 R192 R193 R194 R195 R196 R197 R198 R199 R200 R201 R202 R203 R204 R205 R206 R207 R208 R209 R210 R211 R212 R213 R214 R215 R216 R217 R218 R219 R220 R221 R222 R223 R224 R225 R226 R227 R228 R229 R230 R231 R232 R233 R234 R235 R236 R237 R238 R239 R240 R241 R242 R243 R244 R245 R246 U1 U3 U4 U5 U6 U7 U8 U9 U10 U11 U12 U13 U14 U15 U17 Y1 Y2 Y3 Y4 Y5 Y6